# Altium schematic sheet NRF52840_MICRO.SchDoc: Microcontroller
size Letter; Organization: NewAE Technology Inc.; Address1: 1083 Queen St., Suite 196; Address2: Halifax; Address3: NS; Address4: Canada B3H 0B2; SheetApproved: NO
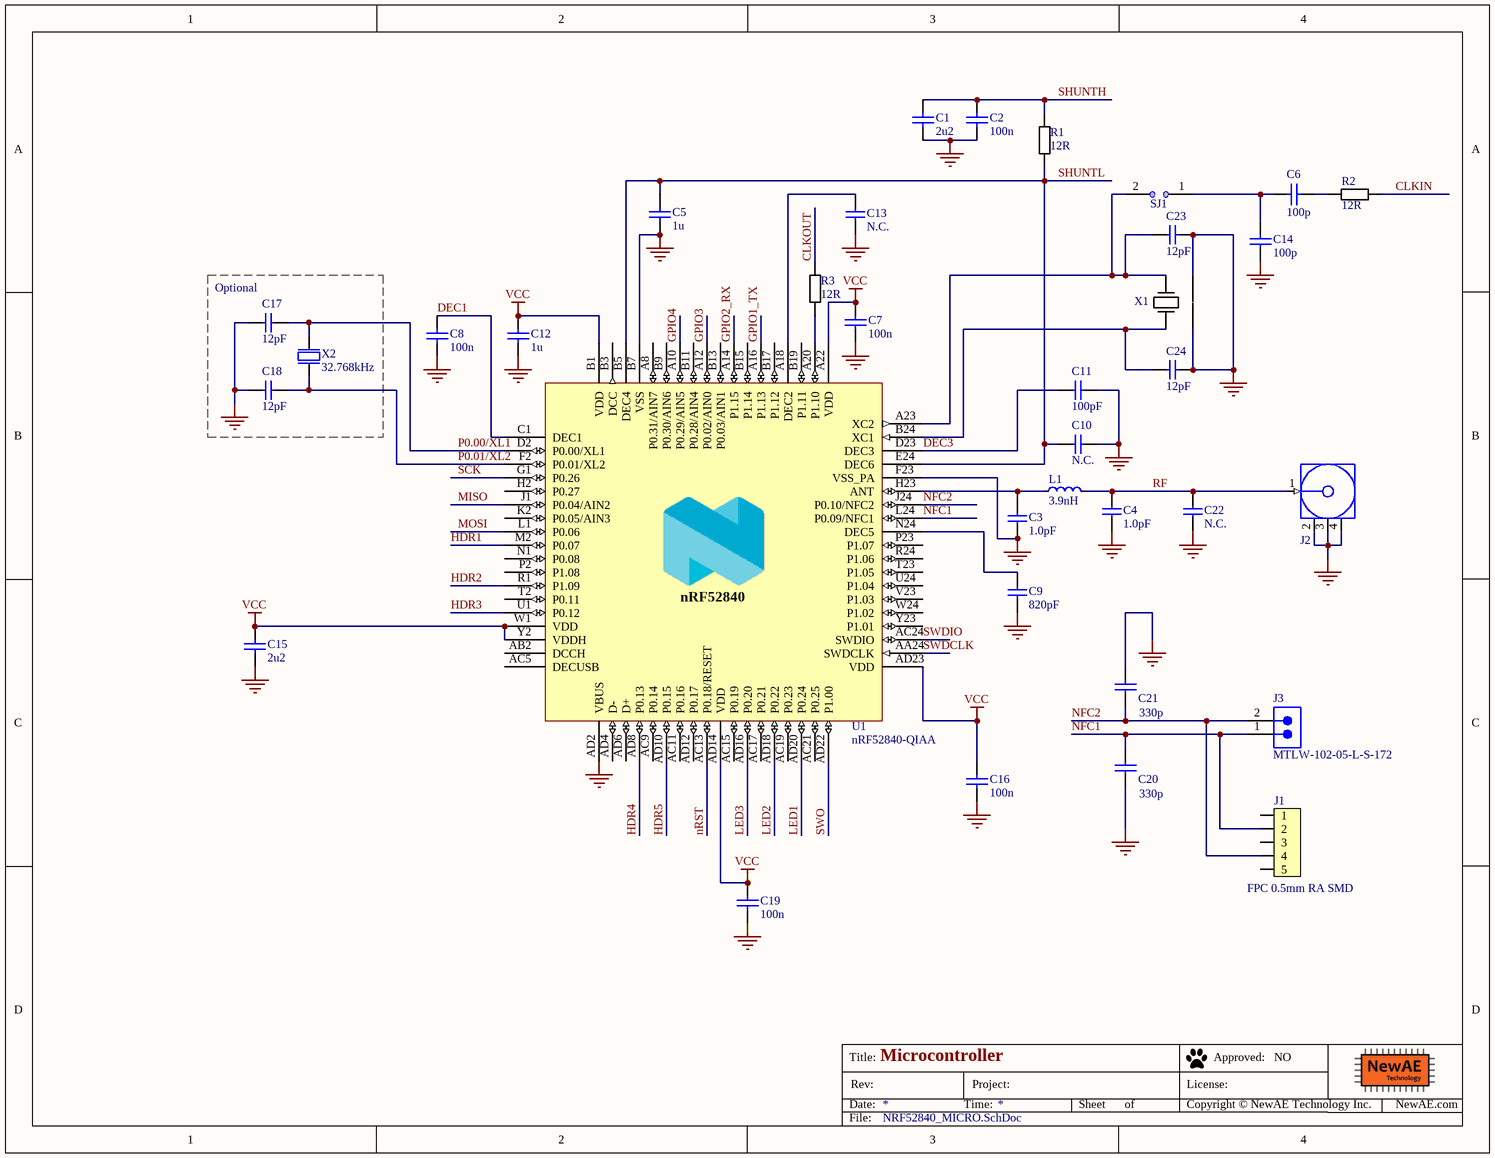
[diagram p0: NRF52840_MICRO.SchDoc]

## Parts
C1  2u2  [CAPC0603_M]
C2  100n  [CAPC0603_M]
C3  1.0pF  [CAPC1005X04L]
C4  1.0pF  [CAPC1005X04L]
C5  1u  [CAPC0603_M]
C6  100p  [CAPC0603_M]
C7  100n  [CAPC0603_M]
C8  100n  [CAPC0603_M]
C9  820pF  [CAPC1005X04L]
C10  N.C.  [CAPC1005X04L]
C11  100pF  [CAPC1005X04L]
C12  1u  [CAPC0603_M]
C13  N.C.  [CAPC1005X04L]
C14  100p  [CAPC0603_M]
C15  2u2  [CAPC0603_M]
C16  100n  [CAPC0603_M]
C17  12pF  [CAPC1005X04L]
C18  12pF  [CAPC1005X04L]
C19  100n  [CAPC0603_M]
C20  330p  [RESC1608X55N]
C21  330p  [RESC1608X55N]
C22  N.C.  [CAPC1005X04L]
C23  12pF  [CAPC1005X04L]
C24  12pF  [CAPC1005X04L]
J1  FPC 0.5mm RA SMD  [FPC_05P-0.5mm-RA-SMD]
J2  0734120110  [0734120110]  (value not drawn)
J3  MTLW-102-05-L-S-172  [SMTC-MTLW-102-05-X-S-172]
L1  3.9nH  [INDC1005X04L]
R1  12R  [RESC1608X55N]
R2  12R  [RESC1608X55N]
R3  12R  [RESC1608X55N]
SJ1  NO  [SJ_2S_NO]  (value not drawn)  (no BOM)
U1  nRF52840-QIAA  [AQFN50P700X700X85_HS-74N]
X1  ABM10AIG-32.000MHZ-4Z-T3  [2.5x2mm XTAL]  (value not drawn)
X2  32.768kHz  [XTAL_3215]

## Blocks framed on the sheet
Optional: C17 C18 X2

## Nets
GND: C1.2 C2.2 C3.1 C4.1 C5.2 C7.2 C8.2 C9.2 C10.1 C11.2 C12.2 C13.2 C14.2 C15.2 C16.2 C17.2 C18.2 C19.2 C20.2 C21.1 C22.2 C23.2 C24.2 J2.2(GND) J2.3(GND) J2.4(GND) U1.74(GND) U1.AD2(VBUS) U1.B7(VSS) U1.F23(VSS_PA) X1.2(GND) X1.4(GND)
VCC: C7.1 C12.1 C15.1 C16.1 C19.1 U1.A22(VDD) U1.AD14(VDD) U1.AD23(VDD) U1.B1(VDD) U1.W1(VDD) U1.Y2(VDDH)
CLKIN: R2.2
CLKOUT: R3.2
DEC1: C8.1 U1.C1(DEC1)
DEC3: C11.1 U1.D23(DEC3)
GPIO1_TX: U1.A16(P1.13)
GPIO2_RX: U1.A14(P1.15)
GPIO3: U1.A12(P0.02/AIN0)
GPIO4: U1.A10(P0.29/AIN5)
HDR1: U1.M2(P0.07)
HDR2: U1.R1(P1.09)
HDR3: U1.U1(P0.12)
HDR4: U1.AD8(P0.13)
HDR5: U1.AD10(P0.15)
LED1: U1.AD20(P0.24)
LED2: U1.AD18(P0.22)
LED3: U1.AD16(P0.20)
MISO: U1.J1(P0.04/AIN2)
MOSI: U1.L1(P0.06)
NFC1: C20.1 J1.2 J3.1 U1.L24(P0.09/NFC1)
NFC2: C21.2 J1.4 J3.2 U1.J24(P0.10/NFC2)
nRST: U1.AC13(P0.18/RESET)
P0.00/XL1: C17.1 U1.D2(P0.00/XL1) X2.1(inp)
P0.01/XL2: C18.1 U1.F2(P0.01/XL2) X2.2(out)
RF: C4.2 C22.1 J2.1(Signal) L1.2
SCK: U1.G1(P0.26)
SHUNTH: C1.1 C2.1 R1.1
SHUNTL: C5.1 C10.2 R1.2 U1.B5(DEC4) U1.E24(DEC6)
SWDCLK: U1.AA24(SWDCLK)
SWDIO: U1.AC24(SWDIO)
SWO: U1.AD22(P1.00)
NetC3_2: C3.2 L1.1 U1.H23(ANT)
NetC6_1: C6.1 C14.1 SJ1.1
NetC6_2: C6.2 R2.1
NetC9_1: C9.1 U1.N24(DEC5)
NetC13_1: C13.1 U1.A18(DEC2)
NetC23_1: C23.1 SJ1.2 U1.A23(XC2) X1.1(IN)
NetC24_1: C24.1 U1.B24(XC1) X1.3(OUT)
NetR3_1: R3.1 U1.A20(P1.10)

Not connected (* = marked no-connect by the designer): J1 1 3 5; U1 A8(P0.31/AIN7) AB2(DCCH) AC5(DECUSB) AC9(P0.14) AC11(P0.16) AC15(P0.19) AC17(P0.21) AC19(P0.23) AC21(P0.25) AD4(D-) AD6(D+) AD12(P0.17) B3(DCC) B9(P0.30/AIN6) B11(P0.28/AIN4) B13(P0.03/AIN1) B15(P1.14) B17(P1.12) B19(P1.11) H2(P0.27) K2(P0.05/AIN3) N1(P0.08) P2(P1.08) P23(P1.07) R24(P1.06) T2(P0.11) T23(P1.05) U24(P1.04) V23(P1.03) W24(P1.02) Y23(P1.01)

## Notes on the sheet
- Title:
- Date:
- Rev:
- Time:
- Project:
- Sheet
- of
- License:
- Copyright © NewAE Technology Inc.
- Approved:
- NewAE.com
- File:
- (in symbol nRF52840-QIAAC0) nRF52840

## Library data of the parts
C1 C15 = CCHIP-2u2-0603: 2u2, 0603; Manufacture 1: Samsung; Manufacture Part Number 1: CL10B225KP8NNNC; Component Group: Capacitor; Case-EIA: 0603; Case-Metric: 1608; Rated Voltage: 10VDC; Part Number: CCHIP-2u2-0603; Footprint: 0603; Pin Count: 2; Supplier 1: Digi-Key; Supplier Part Number 1: 1276-1134-2-ND; Value: 2u2; Mounting Technology: SMT; Component Kind: Standard; Component Type: Standard
C2 C7 C8 C16 C19 = CCHIP-100n-0603: 100n, 0603; Manufacture 1: Kemet; Manufacture Part Number 1: C0603C104K5RACTU; Component Group: Capacitor; Case-EIA: 0603; Case-Metric: 1608; Rated Voltage: 50VDC; Part Number: CCHIP-100n-0603; Footprint: 0603; Pin Count: 2; Supplier 1: Digi-Key; Supplier Part Number 1: 399-5089-2-ND; Value: 100n; Mounting Technology: SMT; Component Kind: Standard; Component Type: Standard
C3 C4 = C0402-1.0p: Capacitor, NP0, ±5%; Note: 50V; Part Number: C0402-1.0p; LatestRevisionDate: 2017-02-23; Pin Count: 2; Publisher: Nordic Semiconductor; Published: 2009-05-08; Value: 1.0pF; Footprint Doc: 0402
C5 C12 = CCHIP-1u-0603: 1u, 0603, 50V; Manufacture Part Number 1: CL10A105KB8NNNC; Component Group: Capacitor; Case-EIA: 0603; Case-Metric: 1608; Rated Voltage: 50VDC; Part Number: CCHIP-1u-0603; Footprint: 0603; Pin Count: 2; Supplier 1: Digi-Key; Supplier Part Number 1: 1276-1860-1-ND; Value: 1u; Mounting Technology: SMT; Component Kind: Standard; Component Type: Standard
C6 C14 = CCHIP-100p-0603: 100p, 0603; Manufacture 1: KEMET; Manufacture Part Number 1: C0603C101K5RACTU; Component Group: Capacitor; Case-EIA: 0603; Case-Metric: 1608; Rated Voltage: 50V; Part Number: CCHIP-100p-0603; Footprint: 0603; Pin Count: 2; Supplier 1: Digi-Key; Supplier Part Number 1: 399-7824-1-ND; Value: 100p; Mounting Technology: SMT; RoHS: Yes; Component Kind: Standard; Component Type: Standard
C9 = C0402-820p: Capacitor, NP0, ±5%; Note: 50V; Part Number: C0402-820p; LatestRevisionDate: 2009-05-08; Pin Count: 2; Publisher: Nordic Semiconductor; Published: 2009-05-08; Value: 820pF; Footprint Doc: 0402
C10 C13 = C0402-N.C.: Not mounted; Assembly: Not mounted; Part Number: C0402-N.C.; LatestRevisionDate: 2009-05-08; Pin Count: 2; Publisher: Nordic Semiconductor; Published: 2009-05-08; Value: N.C.; Footprint Doc: 0402
C11 = C0402-100p: Capacitor, NP0, ±5%; Note: 50V; Part Number: C0402-100p; LatestRevisionDate: 2009-05-08; Pin Count: 2; Publisher: Nordic Semiconductor; Published: 2009-05-08; Value: 100pF; Footprint Doc: 0402
C17 C18 C23 C24 = C0402-12p: Capacitor, NP0, ±2%; Note: 50V; Part Number: C0402-12p; LatestRevisionDate: 2011-05-11; Pin Count: 2; Publisher: Nordic Semiconductor; Published: 2009-05-08; Value: 12pF; Footprint Doc: 0402
C20 C21 = CCHIP-330P-0603-100V: CAP CER 330PF 100V X7R 0603; Manufacture 1: Murata Electronics North America; Manufacture Part Number 1: GRM188R72A331KA01D; Component Group: Capacitor; Case-EIA: 0603; Case-Metric: 1608; Tolerance: ±10%; PP Material Stack: 0; Part Number: CCHIP-330P-0603-100V; Footprint: 0603; Pin Count: 2; Supplier 1: Digi-Key; Supplier Part Number 1: 490-1464-1-ND; Value: 330p; Rated Voltage: 100V; Mounting Technology: SMT; Component Kind: Standard; Component Type: Standard; PP Rotation: 0
C22 = C0402-N.C.: Not mounted; Note: Chip Cap; Assembly: Not mounted; Part Number: C0402-N.C.; LatestRevisionDate: 2009-05-08; Pin Count: 2; Publisher: Nordic Semiconductor; Published: 2009-05-08; Value: N.C.; Footprint Doc: 0402
J1 = FPC_05P-0.5mm-RA-SMD: 0.5mm FPC, 5P,Right Angle SMT,Double Contact,H=1.2mm,White, Tin plated; Manufacturer: W-CON; Manufacturer Part Number: 5141-05RZDNWR01; 2nd source part number: WM9836CT-ND; Part number IPS: 00000007792; Artikkelnr Noca: 55010020; Artikkelnr Simpro: N.A.; Part Number: FPC_05P-0.5mm-RA-SMD; Datasheet: \\hizz\pro\app9717\Datasheet\connectores\W-CON\5141-XXRZDNXX0X.pdf; Footprint Doc: FPC_05P-0.5mm-RA-SMD; LatestRevisionDate: 2016-04-21; Pin Count: 7; Publisher: Nordic Semiconductor; Published: 2015-06-22; Value: FPC 0.5mm RA SMD; Note: *; Supplier: Cabcon; Supplier part number: 5141-05RZDNWR01; 2nd source Supplier: Digi-Key
J2 = UMC_MALE: UMC RCPT STR 50 OHM SMD; Manufacture 1: Molex; Component Group: Connector; PP Material Stack: 0; Part Number: UMC_MALE; Manufacture Part Number 1: 0734120110; Pin Count: 5; Supplier 1: Digi-Key; Supplier Part Number 1: WM5587CT-ND; Mounting Technology: SMT; RoHS: Yes; Component Kind: Standard; Component Type: Standard; PP Rotation: 0
J3 = CMP-1024-00067-1: Manufacturer: Samtec; Pitch: 2.54 mm; ComponentLink1Description: Manufacturer URL; ComponentLink3Description: Package Specification; Orientation: Vertical; PackageReference: MTLW-102-05-X-S-172; ComponentLink2Description: Datasheet; RoHS: True; PartNumber: MTLW-102-05-L-S-172; DatasheetVersion: F-214; ComponentLink2URL: http://www.samtec.com/documents/webfiles/pdf/MTLW_TH.PDF; ComponentLink1URL: http://www.samtec.com; PackageDescription: Low Profile Terminal Assembly; Temperature Range: -55 to 125 degC; Mounting Technology: Through-hole; PackageVersion: T, 6/1991; ComponentLink3URL: http://www.samtec.com/documents/webfiles/cpdf/MTLW-1XX-XX-XX-X-XXX-XX-XX-MKT1.pdf
L1 = L0402-3n9: High frequency chip inductor ±5%; Part Number: L0402-3n9; LatestRevisionDate: 2012-09-19; Pin Count: 2; Publisher: Nordic Semiconductor; Published: 2009-05-08; Value: 3.9nH; Footprint Doc: 0402
R1-R3 = RCHIP-12R-0603: 12R res, 0603, 1%, 1/10W; Manufacture 1: Yageo; Manufacture Part Number 1: RC0603FR-0712RL; Component Group: Resistor; Case-EIA: 0603; Case-Metric: 1608; Rated Power: 0.1W; Rated Voltage: 75VDC; Part Number: RCHIP-12R-0603; Footprint: 0603; Pin Count: 2; Supplier 1: Digi-Key; Supplier Part Number 1: 311-12.0HRCT-ND; Value: 12R; Tolerance: 1%; Mounting Technology: SMT; Temperature Range: -55C to 155C; Component Kind: Standard; Component Type: Standard
SJ1 = SJ_2S_NO: Solder Jumper, NO; Component Group: PCB Feature; Part Number: SJ_2S_NO; Pin Count: 2; Mounting Technology: COPPER; Component Type: Standard (No BOM)
U1 = nRF52840-QIAAC0: Multi-protocol Bluetooth Low Energy, IEEE 802.15.4, ANT and 2.4GHz proprietary system-on-chip; Manufacturer: Nordic Semiconductor; Part Number: nRF52840-QIAAC0; LatestRevisionDate: 2018-02-27; Pin Count: 73; Publisher: Nordic Semiconductor; Published: 2017-08-21; Value: nRF52840-QIAA; Note: *; Footprint Doc: AQFN-73; Manufacturer Part Number: nRF52840-QIAAC0
X1 = ABM10AIG-32.000MHZ-4Z-T3: 32MHz, SMD; Manufacture 1: Abracon LLC; Component Group: Crystal; PP Material Stack: 0; Part Number: ABM10AIG-32.000MHZ-4Z-T3; Manufacture Part Number 1: ABM10AIG-32.000MHZ-4Z-T3; Pin Count: 4; Supplier 1: Digi-Key; Supplier Part Number 1: 535-13368-1-ND; Value: 32.000MHz; Component Kind: Standard; Component Type: Standard; PP Rotation: 0
X2 = XTAL_SMD3215_32.768kHz_9pF_General: XTAL SMD 3215, 32.768kHz, Cl=9pF, Total Tol: ±50ppm; Part Number: XTAL_SMD3215_32.768kHz_9pF_General; LatestRevisionDate: 2016-08-19; Pin Count: 2; Publisher: Nordic Semiconductor; Published: 2016-08-19; Value: 32.768kHz; Footprint Doc: XTAL_3215